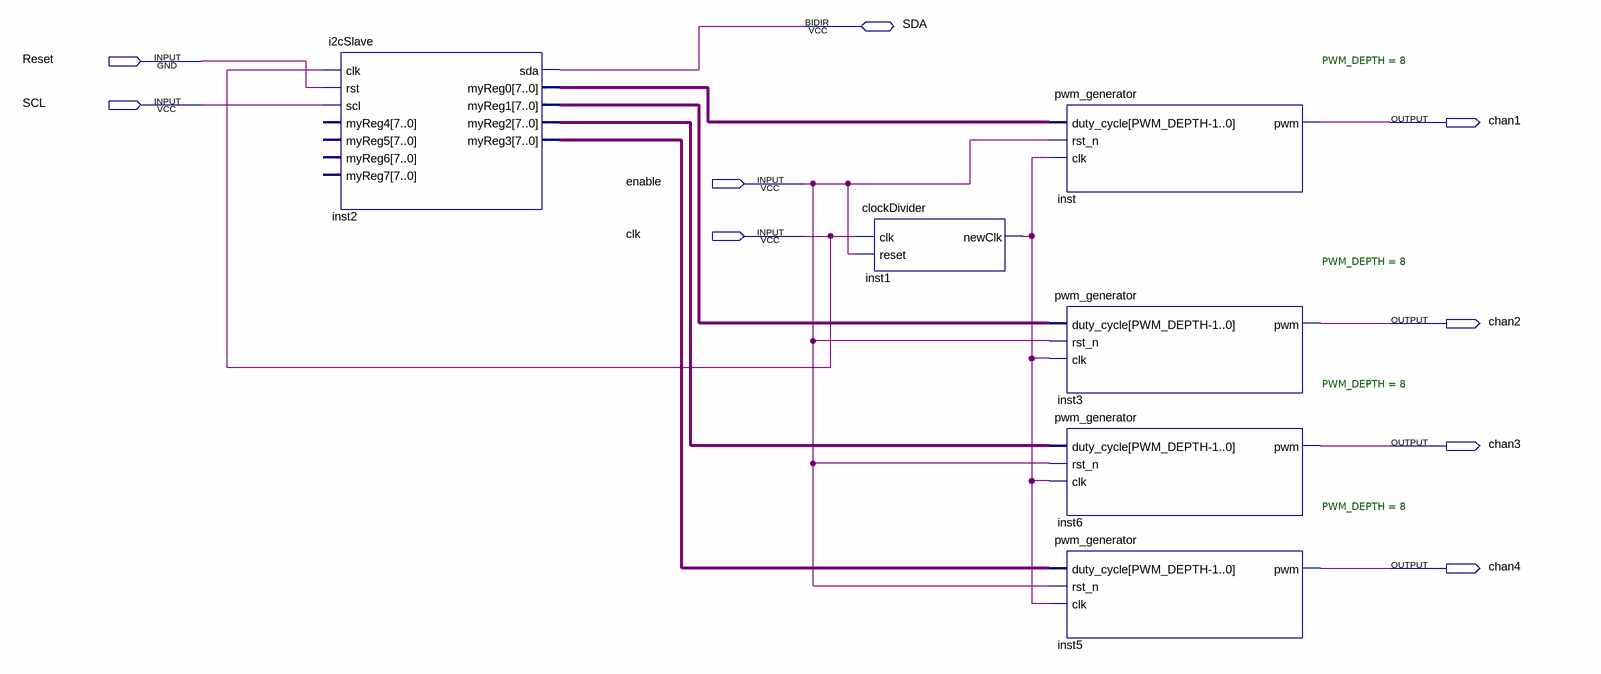
[diagram p0: schematic sheet]
// Quartus schematic ServoController.bdf as structural Verilog: 6 symbols, 9 pins
module ServoController (
  input  Reset,
  input  SCL,
  input  enable,
  input  clk,
  inout  SDA,
  output chan1,
  output chan2,
  output chan3,
  output chan4
);

  wire inst1_newclk;
  wire [7:0] inst2_myreg0, inst2_myreg1, inst2_myreg2, inst2_myreg3;

  i2cSlave inst2 (
    .clk(clk), .rst(Reset), .scl(SCL), .myReg0(inst2_myreg0), .myReg1(inst2_myreg1), .myReg2(inst2_myreg2),
    .myReg3(inst2_myreg3), .sda(SDA));  // open: myReg4, myReg5, myReg6, myReg7
  clockDivider inst1 (.clk(clk), .reset(enable), .newClk(inst1_newclk));
  pwm_generator #(.PWM_DEPTH(8)) inst (.duty_cycle(inst2_myreg0), .rst_n(enable), .clk(inst1_newclk), .pwm(chan1));
  pwm_generator #(.PWM_DEPTH(8)) inst3 (.duty_cycle(inst2_myreg1), .rst_n(enable), .clk(inst1_newclk), .pwm(chan2));
  pwm_generator #(.PWM_DEPTH(8)) inst6 (.duty_cycle(inst2_myreg2), .rst_n(enable), .clk(inst1_newclk), .pwm(chan3));
  pwm_generator #(.PWM_DEPTH(8)) inst5 (.duty_cycle(inst2_myreg3), .rst_n(enable), .clk(inst1_newclk), .pwm(chan4));
endmodule
